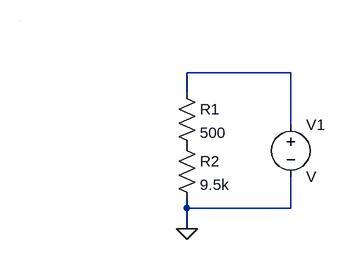
[diagram p0: schematic Draft2.asc]
Draft2.asc, the LTspice schematic file:
Version 4
SHEET 1 880 680
WIRE 416 80 256 80
WIRE 256 112 256 80
WIRE 416 160 416 80
WIRE 256 288 256 272
WIRE 416 288 416 240
WIRE 416 288 256 288
WIRE 256 320 256 288
WIRE 0 0 0 0
FLAG 256 320 0
SYMBOL res 240 96 R0
SYMATTR InstName R1
SYMATTR Value 500
SYMBOL res 240 176 R0
SYMATTR InstName R2
SYMATTR Value 9.5k
SYMBOL voltage 416 144 R0
SYMATTR InstName V1

The netlist it stands for:
* Draft2.asc
R1 N001 P001 500
R2 P001 0 9.5k
V1 N001 0 V
.backanno
.end